# Altium schematic sheet 7 Inch Module.SchDoc: 7" TFT LCD (part 2 of 3)
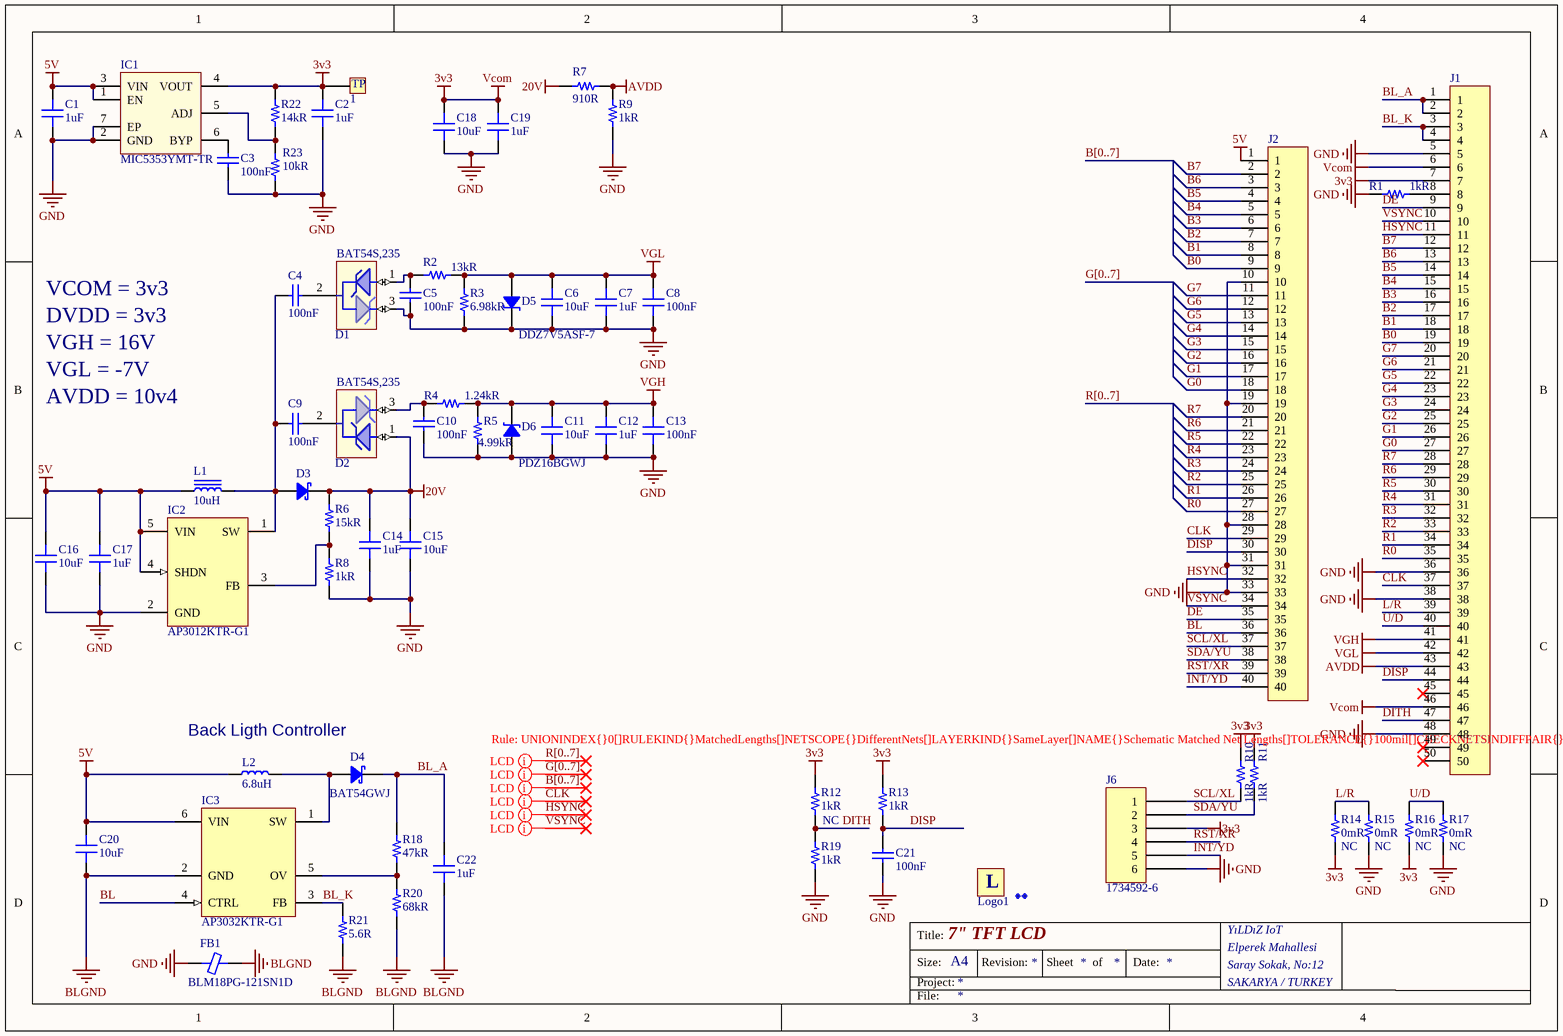
[diagram p1: 7 Inch Module.SchDoc]
## Library data of the parts
1 = Test Point: Custom Test Point
C1 C2 C7 C12 C14 C17 C19 = Capacitor - Ceramic: Ceramic, SMT Capacitor; Manufacturer: Samsung; Manufacturer Part Number: CL10A105KP8NNNC; Tolerance: 10%; Voltage Rating: 10V; Dielectric: X5R; Supplier 1: Digi-Key; Supplier Part Number 1: 1276-1182-1-ND; Stock 1: 4590831; Pricing 1: 1 = 0,10000, 10 = 0,03800, 100 = 0,01680, 500 = 0,01200, 1000 = 0,00943 (USD); RoHS: Yes; Mount: Surface Mount; Case/Package: 0603; Case Code (Metric): 1608; Case Code (Imperial): 0603; Contact Plating: Tin; Min Operating Temperature: -55°C; Max Operating Temperature: 85°C; Packaging: Tape and Reel; Package Quantity: 1; Capacitance: 1uF; Voltage: 10V; Length: 1.6mm; Height: 0.8mm; Width: 0.031inch; Thickness: 0.035inch; Depth: 0.8mm; Radiation Hardening: No; ComponentLink1URL: https://datasheet.ciiva.com/15195/getdatasheetpartid-358616-15195708.pdf?src-supplier=Verical; ComponentLink1Description: https://datasheet.ciiva.com/15195/getdatasheetpartid-358616-15195708.pdf?src-supplier=Verical; ComponentLink2URL: https://datasheet.ciiva.com/16358/cl05b104kq5nnnc-16358431.pdf?src-supplier=Future+Electronics; ComponentLink2Description: https://datasheet.ciiva.com/16358/cl05b104kq5nnnc-16358431.pdf?src-supplier=Future+Electronics
C3-C5 C9 C10 C21 = Cap - Ceramic: Capacitor, Ceramic; Manufacturer: Samsung; Manufacturer Part Number: CL10A104KA8NNNC; Tolerance: 10%; Voltage Rating: 25V; Dielectric: X5R; Supplier 1: Digi-Key; Supplier Part Number 1: 1276-1857-1-ND; Stock 1: 978306; Pricing 1: 1 = 0,10000, 10 = 0,04600, 100 = 0,02070, 500 = 0,01478, 1000 = 0,01162 (USD); RoHS: Yes; Mount: Surface Mount; Case/Package: 0603; Case Code (Metric): 1608; Case Code (Imperial): 0603; Contact Plating: Tin; Min Operating Temperature: -55°C; Max Operating Temperature: 85°C; Package Quantity: 1; Packaging: Tape and Reel; Capacitance: 100nF; Voltage Rating (DC): 25V; Termination: Wraparound; Length: 0.063inch; Width: 0.031inch; Thickness: 0.035inch; Lead Free: Lead Free; ComponentLink1URL: http://www.samsungsem.com/kr/support/library/product-catalog/mlcc.jsp; ComponentLink1Description: http://www.samsungsem.com/kr/support/library/product-catalog/mlcc.jsp; Price: 0,1
C6 C11 C15 C16 C18 C20 = Capacitor - Ceramic: Ceramic, SMT Capacitor; Manufacturer: Samsung; Manufacturer Part Number: CL10A106MQ8NNNC; Tolerance: 20%; Voltage Rating: 6.3V; Dielectric: X5R; Supplier 1: Digi-Key; Supplier Part Number 1: 1276-1119-1-ND; Stock 1: 4408315; Pricing 1: 1 = 0,15000, 10 = 0,11000, 100 = 0,05150, 500 = 0,03614, 1000 = 0,02992 (USD); RoHS: Yes; Mount: Surface Mount; Case/Package: 0603; Case Code (Metric): 1608; Case Code (Imperial): 0603; Contact Plating: Tin; Min Operating Temperature: -55°C; Max Operating Temperature: 85°C; Package Quantity: 1; Packaging: Tape and Reel; Capacitance: 10uF; Voltage: 6.3V; Length: 1.6mm; Height: 0.8mm; Width: 0.031inch; Thickness: 0.035inch; Depth: 0.8mm; Radiation Hardening: No; ComponentLink1URL: https://datasheet.ciiva.com/25798/cl10a106mq8nnnc-25798320.pdf?src-supplier=Digi-Key; ComponentLink1Description: https://datasheet.ciiva.com/25798/cl10a106mq8nnnc-25798320.pdf?src-supplier=Digi-Key; ComponentLink2URL: https://datasheet.ciiva.com/26838/getdatasheetpartid-357557-26838347.pdf?src-supplier=Verical; ComponentLink2Description: https://datasheet.ciiva.com/26838/getdatasheetpartid-357557-26838347.pdf?src-supplier=Verical; ComponentLink3URL: https://datasheet.ciiva.com/16437/cl05b104kq5nnnc-16437327.pdf?src-supplier=Future+Electronics; ComponentLink3Description: https://datasheet.ciiva.com/16437/cl05b104kq5nnnc-16437327.pdf?src-supplier=Future+Electronics
C8 C13 = Capacitor - Ceramic: Ceramic, SMT Capacitor; Manufacturer: Samsung; Manufacturer Part Number: CL10A104KA8NNNC; Dielectric: X5R; Voltage Rating (DC): 25V; Tolerance: 10%; ComponentLink1URL: https://datasheet.ciiva.com/15195/getdatasheetpartid-358616-15195708.pdf?src-supplier=Verical; ComponentLink1Description: https://datasheet.ciiva.com/15195/getdatasheetpartid-358616-15195708.pdf?src-supplier=Verical; ComponentLink2URL: https://datasheet.ciiva.com/16358/cl05b104kq5nnnc-16358431.pdf?src-supplier=Future+Electronics; ComponentLink2Description: https://datasheet.ciiva.com/16358/cl05b104kq5nnnc-16358431.pdf?src-supplier=Future+Electronics; Supplier 1: Digi-Key; Supplier Part Number 1: 1276-1857-1-ND; Stock 1: 1217365; Pricing 1: 1 = 0,10000, 10 = 0,04500, 100 = 0,02000, 500 = 0,01428, 1000 = 0,01122 (USD); RoHS: Yes; Mount: Surface Mount; Case/Package: 0603; Contact Plating: Tin; Case Code (Metric): 1608; Case Code (Imperial): 0603; Min Operating Temperature: -55°C; Max Operating Temperature: 85°C; Termination: Wraparound; Package Quantity: 1; Packaging: Tape and Reel; Capacitance: 100nF; Voltage Rating: 25V; Length: 0.063inch; Thickness: 0.035inch; Width: 0.031inch; Lead Free: Lead Free; ComponentLink3URL: https://datasheet.ciiva.com/25780/cl10a104ka8nnnc-25780966.pdf?src-supplier=Digi-Key; ComponentLink3Description: https://datasheet.ciiva.com/25780/cl10a104ka8nnnc-25780966.pdf?src-supplier=Digi-Key
C22 = Capacitor - Ceramic: Ceramic, SMT Capacitor; Manufacturer: Samsung; Manufacturer Part Number: CL10A105KO8NNNC; Tolerance: 10%; Voltage Rating: 16V; Dielectric: X5R; Supplier 1: Digi-Key; Supplier Part Number 1: 1276-1034-1-ND; Stock 1: 800480; Pricing 1: 1 = 0,10000, 10 = 0,03800, 100 = 0,01680, 500 = 0,01198, 1000 = 0,00941 (USD); RoHS: Yes; Mount: Surface Mount; Case/Package: 0603; Case Code (Metric): 1608; Case Code (Imperial): 0603; Material: Ceramic; Contact Plating: Tin; Min Operating Temperature: -55°C; Max Operating Temperature: 85°C; Package Quantity: 1; Packaging: Tape and Reel; Capacitance: 1uF; Voltage: 16V; Voltage Rating (DC): 16V; Length: 1.6mm; Height: 0.8mm; Width: 0.031inch; Thickness: 0.035inch; Depth: 0.8mm; Radiation Hardening: No; Lead Free: Lead Free; ComponentLink1URL: http://www1.futureelectronics.com/doc/SAMSUNG/CL10A105KO8NNNC.pdf?src-supplier=Future+Electronics; ComponentLink1Description: http://www1.futureelectronics.com/doc/SAMSUNG/CL10A105KO8NNNC.pdf?src-supplier=Future+Electronics; ComponentLink2URL: https://www.verical.com/server-webapp/html/getDatasheet?partID=359688&src-supplier=Verical; ComponentLink2Description: https://www.verical.com/server-webapp/html/getDatasheet?partID=359688&src-supplier=Verical; ComponentLink3URL: https://produktinfo.conrad.com/datenblaetter/450000-474999/458190-da-01-en-VS_KONDENSATOR_0603.pdf?src-supplier=Conrad; ComponentLink3Description: https://produktinfo.conrad.com/datenblaetter/450000-474999/458190-da-01-en-VS_KONDENSATOR_0603.pdf?src-supplier=Conrad
D1 D2 = Diode Schottky Barier Array: TVS Array; Manufacturer: Nexperia; ComponentLink2Description: SMD; Supplier 1: Digi-Key; Supplier Part Number 1: 1727-1868-1-ND; Manufacturer Part Number: BAT54S,235; Stock 1: 9232; Pricing 1: 1 = 0,14000, 10 = 0,12500, 25 = 0,11880, 100 = 0,05230, 250 = 0,05016, 500 = 0,04104, 1000 = 0,02850, 2500 = 0,02489, 5000 = 0,02233 (USD); RoHS: No; ComponentLink1URL: https://assets.nexperia.com/documents/data-sheet/BAT54_SER.pdf?src-supplier=Digi-Key; ComponentLink1Description: https://assets.nexperia.com/documents/data-sheet/BAT54_SER.pdf?src-supplier=Digi-Key
D3 = Diode Schottky: Zener Diode; Manufacturer: Diodes; Forward Voltage: 450mV; Forward Current: 1A; Max Power Dissipation: 450mW; Max Repetitive Reverse Voltage (Vrrm): 40V; Max Forward Surge Current (Ifsm): 25A; Polarity: Standard; Capacitance: 110pF; Peak Reverse Current: 50uA; Element Configuration: Single; Supplier 1: Digi-Key; Supplier Part Number 1: 1N5819HW-FDICT-ND; Manufacturer Part Number: 1N5819HW-7-F; Stock 1: 392857; Pricing 1: 1 = 0,40000, 10 = 0,30100, 25 = 0,26360, 100 = 0,14310, 250 = 0,14240, 500 = 0,11678, 1000 = 0,08664 (USD); RoHS: Yes; Case/Package: SOD-123-2; Number of Pins: 2; Weight: 0.000353oz; Contact Plating: Tin,Matte; Min Operating Temperature: -65°C; Max Operating Temperature: 125°C; Package Quantity: 3000; Average Rectified Current: 1A; Peak Non-Repetitive Surge Current: 25A; Termination: SMD/SMT; Voltage Rating (DC): 40V; Current Rating: 1A; Max Reverse Voltage (DC): 40V; Output Current: 1A; Packaging: Tape and Reel; Length: 2.85mm; Height: 1.25mm; Width: 1.7mm; Radiation Hardening: No; REACH SVHC: No SVHC; Lead Free: Lead Free; ComponentLink1URL: https://datasheet.ciiva.com/16303/ds30217-16303296.pdf?src-supplier=Future+Electronics; ComponentLink1Description: https://datasheet.ciiva.com/16303/ds30217-16303296.pdf?src-supplier=Future+Electronics; ComponentLink2URL: https://datasheet.ciiva.com/27092/1538419-27092484.pdf?src-supplier=Jameco; ComponentLink2Description: https://datasheet.ciiva.com/27092/1538419-27092484.pdf?src-supplier=Jameco; ComponentLink3URL: https://datasheet.ciiva.com/912/ds30217-912801.pdf?src-supplier=Digi-Key; ComponentLink3Description: https://datasheet.ciiva.com/912/ds30217-912801.pdf?src-supplier=Digi-Key; ComponentLink4URL: https://datasheet.ciiva.com/912/ds30217-912803.pdf?src-supplier=Digi-Key; ComponentLink4Description: https://datasheet.ciiva.com/912/ds30217-912803.pdf?src-supplier=Digi-Key; ComponentLink5URL: https://datasheet.ciiva.com/8303/ds30217-8303132.pdf?src-supplier=Avnet; ComponentLink5Description: https://datasheet.ciiva.com/8303/ds30217-8303132.pdf?src-supplier=Avnet; ComponentLink6URL: https://datasheet.ciiva.com/25919/ds30217-25919644.pdf?src-supplier=Avnet+Europe; ComponentLink6Description: https://datasheet.ciiva.com/25919/ds30217-25919644.pdf?src-supplier=Avnet+Europe; ComponentLink7URL: https://datasheet.ciiva.com/1177/ds30217-1177089.pdf?src-supplier=Element14; ComponentLink7Description: https://datasheet.ciiva.com/1177/ds30217-1177089.pdf?src-supplier=Element14; ComponentLink8URL: https://datasheet.ciiva.com/912/ds30217-912802.pdf?src-supplier=Digi-Key; ComponentLink8Description: https://datasheet.ciiva.com/912/ds30217-912802.pdf?src-supplier=Digi-Key
D4 = Diode Schottky: Zener Diode; Manufacturer: NXP Semiconductors; Supplier 1: Digi-Key; Supplier Part Number 1: 1727-7328-1-ND; Manufacturer Part Number: BAT54GWJ; Stock 1: 35357; Pricing 1: 1 = 0,14000, 10 = 0,13100, 100 = 0,07140, 500 = 0,04396, 1000 = 0,02997 (USD)
D5 = Diode Zener: Zener Diode; Manufacturer: Diodes; Description: Diodes Inc DDZ7V5ASF-7 Zener Diode, 7.0V 2.5% 500 mW SMT 2-Pin SOD-323F; Voltage Tolerance: 2.63%; Zener Current: 7.5uA; Forward Voltage: 900mV; Zener Voltage: 7.04V; Impedance: 30R; Test Current: 20mA; Element Configuration: Single; Power Rating: 500mW; Tolerance: 3%; Supplier 1: Digi-Key; Supplier Part Number 1: DDZ7V5ASF-7DICT-ND; Manufacturer Part Number: DDZ7V5ASF-7; Stock 1: 16; Pricing 1: 1 = 0,15000, 10 = 0,14100, 25 = 0,13400, 100 = 0,05890, 250 = 0,05656, 500 = 0,04626, 1000 = 0,03213 (USD); RoHS: Yes; Mount: Surface Mount; Number of Pins: 2; Min Operating Temperature: -65°C; Max Operating Temperature: 150°C; Peak Reverse Current: 7.5uA; Max Reverse Leakage Current: 7.5uA; Max Power Dissipation: 500mW; Package Quantity: 3000; Packaging: Tape and Reel; Length: 2.5mm; Height: 0.75mm; Width: 1.25mm; Radiation Hardening: No; Lead Free: Lead Free; REACH SVHC: No SVHC; ComponentLink1URL: https://datasheet.ciiva.com/30478/0900766b8115c2de-30478492.pdf?src-supplier=RSComponents; ComponentLink1Description: https://datasheet.ciiva.com/30478/0900766b8115c2de-30478492.pdf?src-supplier=RSComponents; ComponentLink2URL: https://datasheet.ciiva.com/13079/ds31987-65362-13079116.pdf?src-supplier=Mouser; ComponentLink2Description: https://datasheet.ciiva.com/13079/ds31987-65362-13079116.pdf?src-supplier=Mouser
D6 = Diode Zener: Zener Diode; Manufacturer: Nexperia; Description: PDZ-B Series 16 V ±2% 400 mW Surface Mount Voltage Regulator Diode - SOD-323; Supplier 1: Digi-Key; Supplier Part Number 1: 1727-7765-1-ND; Manufacturer Part Number: PDZ16BGWJ; Stock 1: 19182; Pricing 1: 1 = 0,17000, 10 = 0,15400, 25 = 0,14640, 100 = 0,06440, 250 = 0,06176, 500 = 0,05054, 1000 = 0,03510, 2500 = 0,03066, 5000 = 0,02750 (USD); RoHS: No
FB1 = Ferrite Chip: SMT Ferrite Chip; Manufacturer: Murata; Material: Ferrite,Steel; Tolerance: 25%; Impedance: 120R; Max Current Rating: 2A; Number of Lines: 1; DC Resistance (DCR): 50mR; Test Frequency: 100MHz; Shielding: Unshielded; Supplier 1: Digi-Key; Supplier Part Number 1: 490-1037-1-ND; Manufacturer Part Number: BLM18PG-121SN1D; Stock 1: 1352097; Pricing 1: 1 = 0,10000, 10 = 0,07600, 25 = 0,06840, 50 = 0,05000, 100 = 0,04330, 250 = 0,03416, 500 = 0,02884, 1000 = 0,02429 (USD); RoHS: Yes; Case/Package: 0603; Number of Pins: 2; Core Material: Ferrite; Case Code (Metric): 1608; Case Code (Imperial): 0603; Min Operating Temperature: -55°C; Max Operating Temperature: 125°C; Package Quantity: 1; Packaging: Tape and Reel; Current Rating: 2A; Max DC Current: 2A; Termination: SMD/SMT; DC Current: 2A; Frequency: 100MHz; Number of Circuits: 1; Length: 1.6mm; Height: 0.8mm; Width: 0.8mm; Depth: 0.8mm; Radiation Hardening: No; REACH SVHC: No SVHC; Lead Free: Lead Free; ComponentLink1URL: http://www.farnell.com/datasheets/1740433.pdf?src-supplier=Avnet; ComponentLink1Description: http://www.farnell.com/datasheets/1740433.pdf?src-supplier=Avnet; ComponentLink2URL: http://www.farnell.com/datasheets/1740433.pdf?src-supplier=Farnell; ComponentLink2Description: http://www.farnell.com/datasheets/1740433.pdf?src-supplier=Farnell; ComponentLink3URL: http://www.farnell.com/datasheets/1740433.pdf?src-supplier=Element14; ComponentLink3Description: http://www.farnell.com/datasheets/1740433.pdf?src-supplier=Element14; ComponentLink4URL: https://www.murata.com/en-us/products/productdata/8796738650142/ENFA0003.pdf?src-supplier=Digi-Key; ComponentLink4Description: https://www.murata.com/en-us/products/productdata/8796738650142/ENFA0003.pdf?src-supplier=Digi-Key; ComponentLink5URL: http://www.farnell.com/datasheets/1740433.pdf?src-supplier=Arrow; ComponentLink5Description: http://www.farnell.com/datasheets/1740433.pdf?src-supplier=Arrow; ComponentLink6URL: http://www.farnell.com/datasheets/1740433.pdf?src-supplier=Distrelec; ComponentLink6Description: http://www.farnell.com/datasheets/1740433.pdf?src-supplier=Distrelec; ComponentLink7URL: http://uk.rs-online.com/webdocs/13d6/0900766b813d688c.pdf?src-supplier=RSComponents; ComponentLink7Description: http://uk.rs-online.com/webdocs/13d6/0900766b813d688c.pdf?src-supplier=RSComponents; ComponentLink8URL: http://www.farnell.com/datasheets/1740433.pdf?src-supplier=Jameco; ComponentLink8Description: http://www.farnell.com/datasheets/1740433.pdf?src-supplier=Jameco; ComponentLink9URL: http://www.farnell.com/datasheets/1740433.pdf?src-supplier=Avnet+Europe; ComponentLink9Description: http://www.farnell.com/datasheets/1740433.pdf?src-supplier=Avnet+Europe; ComponentLink10URL: http://www.produktinfo.conrad.com/datenblaetter/425000-449999/442365-da-01-en-CHIP_DROSSEL_0603_120R_2000MA_1_6X0_8MM.pdf?src-supplier=Conrad; ComponentLink10Description: http://www.produktinfo.conrad.com/datenblaetter/425000-449999/442365-da-01-en-CHIP_DROSSEL_0603_120R_2000MA_1_6X0_8MM.pdf?src-supplier=Conrad; ComponentLink11URL: http://www.produktinfo.conrad.com/datenblaetter/1100000-1199999/001172297-da-01-en-DROSSEL_0603_120R_1_6X0_8MM_4000ST.pdf?src-supplier=Conrad; ComponentLink11Description: http://www.produktinfo.conrad.com/datenblaetter/1100000-1199999/001172297-da-01-en-DROSSEL_0603_120R_1_6X0_8MM_4000ST.pdf?src-supplier=Conrad
Fid1 Fid2 = Fiducial: Part Number: Fid-Mark; Artikkelnr Noca: N.A.; Manufacturer: *; Manufacturer Part Number: *; Datasheet: *; LatestRevisionDate: 2009-12-12; Pin Count: 1; Publisher: Nordic Semiconductor; Published: 2009-12-12; Value: *; Note: *; Supplier: *; Supplier part number: *; 2nd source Supplier: *; 2nd source part number: *; Footprint Doc: Fiducial; Artikkelnr Simpro: N.A.
IC1 = MICROCHIP MIC5353: Integrated Circuit; ComponentLink1URL: http://www.farnell.com/datasheets/2245202.pdf?src-supplier=Farnell; ComponentLink1Description: http://www.farnell.com/datasheets/2245202.pdf?src-supplier=Farnell; ComponentLink2URL: http://www.microchip.com/mymicrochip/filehandler.aspx?ddocname=en579989&src-supplier=Digi-Key; ComponentLink2Description: http://www.microchip.com/mymicrochip/filehandler.aspx?ddocname=en579989&src-supplier=Digi-Key; ComponentLink3URL: http://www.farnell.com/datasheets/1692673.pdf?src-supplier=Element14; ComponentLink3Description: http://www.farnell.com/datasheets/1692673.pdf?src-supplier=Element14; Supplier 1: Digi-Key; Supplier Part Number 1: 576-3681-1-ND; Manufacturer: Microchip; Manufacturer Part Number: MIC5353YMT-TR; Stock 1: 1004; Pricing 1: 1 = 0,34000, 25 = 0,28000, 100 = 0,26000 (USD); RoHS: Yes; ComponentLink4URL: https://datasheet.ciiva.com/2049/mic5353-2049344.pdf?src-supplier=Digi-Key; ComponentLink4Description: https://datasheet.ciiva.com/2049/mic5353-2049344.pdf?src-supplier=Digi-Key; ComponentLink5URL: https://datasheet.ciiva.com/2049/mic5353-2049342.pdf?src-supplier=Digi-Key; ComponentLink5Description: https://datasheet.ciiva.com/2049/mic5353-2049342.pdf?src-supplier=Digi-Key; ComponentLink6URL: https://datasheet.ciiva.com/2049/mic5353-2049343.pdf?src-supplier=Digi-Key; ComponentLink6Description: https://datasheet.ciiva.com/2049/mic5353-2049343.pdf?src-supplier=Digi-Key
IC2 = DIODES AP3012: 1.5MHz STEP-UP DC-DC CONVERTER; Manufacturer: Diodes; Output Voltage: 29V; Operating Supply Current: 100nA; Min Supply Voltage: 1V; Number of Outputs: 1; Max Output Current: 500mA; Min Output Voltage: 1.25V; Min Input Voltage: 2.6V; Max Input Voltage: 16V; Efficiency: 85%; Synchronous Rectifier: No; Topology: Boost; Output Type: Adjustable; Output Configuration: Positive; Supplier 1: Digi-Key; Supplier Part Number 1: AP3012KTR-G1DICT-ND; Manufacturer Part Number: AP3012KTR-G1; Stock 1: 30355; Pricing 1: 1 = 0,47000, 10 = 0,38000, 25 = 0,34760, 100 = 0,23430, 250 = 0,19392, 500 = 0,17776, 1000 = 0,13332 (USD); RoHS: Yes; Mount: Surface Mount; Case/Package: SOT-23-5; Number of Pins: 5; Weight: 0.001058oz; Min Operating Temperature: -40°C; Max Operating Temperature: 85°C; Packaging: Tape and Reel; Max Output Voltage: 29V; Output Current: 500mA; Switching Frequency: 1.5MHz; Package Quantity: 3000; Operating Supply Voltage: 16V; Lead Free: Lead Free; ComponentLink1URL: https://datasheet.ciiva.com/29885/ap3012-29885792.pdf?src-supplier=Avnet; ComponentLink1Description: https://datasheet.ciiva.com/29885/ap3012-29885792.pdf?src-supplier=Avnet; ComponentLink2URL: https://datasheet.ciiva.com/29735/ap3012-29735077.pdf?src-supplier=Digi-Key; ComponentLink2Description: https://datasheet.ciiva.com/29735/ap3012-29735077.pdf?src-supplier=Digi-Key; ComponentLink3URL: https://datasheet.ciiva.com/29735/ap3012-29735068.pdf?src-supplier=Digi-Key; ComponentLink3Description: https://datasheet.ciiva.com/29735/ap3012-29735068.pdf?src-supplier=Digi-Key
IC3 = DIODES AP3032: Manufacturer: Diodes; Number of Outputs: 1; Frequency: 1MHz; Max Supply Voltage: 9V; Output Current per Channel: 1.4A; Min Input Voltage: 2.7V; Max Output Voltage: 38V; Switching Frequency: 750kHz; Topology: Boost; Dimming: PWM; Supplier 1: Digi-Key; Supplier Part Number 1: AP3032KTR-G1DICT-ND; Manufacturer Part Number: AP3032KTR-G1; Stock 1: 8311; Pricing 1: 1 = 0,48000, 10 = 0,36500, 100 = 0,22740, 500 = 0,15558, 1000 = 0,11968 (USD); RoHS: Yes; Mount: Surface Mount; Case/Package: SOT-23-6; Number of Pins: 6; Weight: 0.000529oz; Min Operating Temperature: -40°C; Max Operating Temperature: 85°C; Package Quantity: 3000; Packaging: Tape and Reel; Max Input Voltage: 9V; Number of Channels: 1; Lead Free: Lead Free; ComponentLink1URL: https://www.diodes.com/assets/Datasheets/AP3032.pdf?src-supplier=Digi-Key; ComponentLink1Description: https://www.diodes.com/assets/Datasheets/AP3032.pdf?src-supplier=Digi-Key
J1 = FPC-50: Connector; Manufacturer: Amphenol FCI; Actuator Material: Glass,Thermoplastic; Current Rating: 500mA; Voltage Rating: 50V; Contact Resistance: 30mR; Number of Positions: 50; Contact Location: Bottom; Insulation Resistance: 100MR; Gender: Receptacle; Pitch: 0.5mm; Supplier 1: Digi-Key; Supplier Part Number 1: 609-1197-1-ND; Manufacturer Part Number: 62684-501100ALF; Stock 1: 6713; Pricing 1: 1 = 0,96000, 10 = 0,84700, 25 = 0,79680, 50 = 0,76360, 100 = 0,73040, 250 = 0,66396, 500 = 0,59756, 1000 = 0,53117 (USD); RoHS: Yes; Mount: Surface Mount; Contact Material: Bronze; Contact Plating: Gold; Housing Color: Beige; Housing Material: Thermoplastic; Min Operating Temperature: -55°C; Max Operating Temperature: 85°C; Package Quantity: 2000; Packaging: Tape and Reel; Number of Rows: 1; Orientation: Right Angle; Termination: Solder; Number of Contacts: 50; Max Voltage Rating (AC): 50V; Max Voltage Rating (DC): 50V; Length: 30.5mm; Width: 5mm; Depth: 5mm; Radiation Hardening: No; REACH SVHC: No SVHC; Lead Free: Lead Free; Flammability Rating: UL94 V-0; ComponentLink1URL: https://datasheet.ciiva.com/670/62684-670208.pdf?src-supplier=Digi-Key; ComponentLink1Description: https://datasheet.ciiva.com/670/62684-670208.pdf?src-supplier=Digi-Key; ComponentLink2URL: https://datasheet.ciiva.com/15176/getdatasheetpartid-175576-15176517.pdf?src-supplier=Verical; ComponentLink2Description: https://datasheet.ciiva.com/15176/getdatasheetpartid-175576-15176517.pdf?src-supplier=Verical; ComponentLink3URL: https://datasheet.ciiva.com/16660/62684-16660229.pdf?src-supplier=Avnet+Europe; ComponentLink3Description: https://datasheet.ciiva.com/16660/62684-16660229.pdf?src-supplier=Avnet+Europe; ComponentLink4URL: https://datasheet.ciiva.com/10367/62684-10367670.pdf?src-supplier=Avnet; ComponentLink4Description: https://datasheet.ciiva.com/10367/62684-10367670.pdf?src-supplier=Avnet; ComponentLink5URL: https://datasheet.ciiva.com/8038/62684-8038135.pdf?src-supplier=Element14; ComponentLink5Description: https://datasheet.ciiva.com/8038/62684-8038135.pdf?src-supplier=Element14; ComponentLink6URL: https://datasheet.ciiva.com/14640/70236842-14640812.pdf?src-supplier=Allied+Electronics; ComponentLink6Description: https://datasheet.ciiva.com/14640/70236842-14640812.pdf?src-supplier=Allied+Electronics; ComponentLink7URL: https://datasheet.ciiva.com/670/62684-670206.pdf?src-supplier=Digi-Key; ComponentLink7Description: https://datasheet.ciiva.com/670/62684-670206.pdf?src-supplier=Digi-Key; ComponentLink8URL: https://datasheet.ciiva.com/670/62684-670207.pdf?src-supplier=Digi-Key; ComponentLink8Description: https://datasheet.ciiva.com/670/62684-670207.pdf?src-supplier=Digi-Key
J2 = FPC-40: Connector; Manufacturer: Amphenol FCI; Actuator Material: Glass,Thermoplastic; Number of Positions: 40; Current Rating: 500mA; Voltage Rating: 50V; Contact Location: Bottom; Insulation Resistance: 100MR; Gender: Receptacle; Contact Resistance: 30mR; Pitch: 0.5mm; Supplier 1: Digi-Key; Supplier Part Number 1: 609-1195-1-ND; Manufacturer Part Number: 62684-401100ALF; Stock 1: 13351; Pricing 1: 1 = 0,97000, 10 = 0,85600, 25 = 0,80600, 50 = 0,77240, 100 = 0,73880, 250 = 0,67168, 500 = 0,60450, 1000 = 0,53733 (USD); RoHS: Yes; Mount: Surface Mount; Housing Material: Thermoplastic; Housing Color: Beige; Contact Material: Bronze; Contact Plating: Gold; Min Operating Temperature: -55°C; Max Operating Temperature: 85°C; Termination: Solder; Packaging: Tape and Reel; Orientation: Right Angle; Number of Contacts: 40; Max Voltage Rating (AC): 50V; Max Voltage Rating (DC): 50V; Number of Rows: 1; Package Quantity: 2000; Length: 25.5mm; Depth: 5mm; Width: 5mm; Flammability Rating: UL94 V-0; REACH SVHC: No SVHC; Lead Free: Lead Free; ComponentLink1URL: https://datasheet.ciiva.com/25631/0900766b8118e51f-25631168.pdf?src-supplier=RSComponents; ComponentLink1Description: https://datasheet.ciiva.com/25631/0900766b8118e51f-25631168.pdf?src-supplier=RSComponents; ComponentLink2URL: https://datasheet.ciiva.com/3112/62684-3112007.pdf?src-supplier=Avnet; ComponentLink2Description: https://datasheet.ciiva.com/3112/62684-3112007.pdf?src-supplier=Avnet; ComponentLink3URL: https://datasheet.ciiva.com/670/62684-670200.pdf?src-supplier=Digi-Key; ComponentLink3Description: https://datasheet.ciiva.com/670/62684-670200.pdf?src-supplier=Digi-Key; ComponentLink4URL: https://datasheet.ciiva.com/670/62684-670201.pdf?src-supplier=Digi-Key; ComponentLink4Description: https://datasheet.ciiva.com/670/62684-670201.pdf?src-supplier=Digi-Key; ComponentLink5URL: https://datasheet.ciiva.com/670/62684-670202.pdf?src-supplier=Digi-Key; ComponentLink5Description: https://datasheet.ciiva.com/670/62684-670202.pdf?src-supplier=Digi-Key; ComponentLink6URL: https://datasheet.ciiva.com/16659/62684-16659882.pdf?src-supplier=Avnet+Europe; ComponentLink6Description: https://datasheet.ciiva.com/16659/62684-16659882.pdf?src-supplier=Avnet+Europe; ComponentLink7URL: https://datasheet.ciiva.com/16709/70236840-16709916.pdf?src-supplier=Allied+Electronics; ComponentLink7Description: https://datasheet.ciiva.com/16709/70236840-16709916.pdf?src-supplier=Allied+Electronics; ComponentLink8URL: https://datasheet.ciiva.com/3112/62684-3112397.pdf?src-supplier=Avnet; ComponentLink8Description: https://datasheet.ciiva.com/3112/62684-3112397.pdf?src-supplier=Avnet; ComponentLink9URL: https://datasheet.ciiva.com/5772/62684-5772782.pdf?src-supplier=Farnell; ComponentLink9Description: https://datasheet.ciiva.com/5772/62684-5772782.pdf?src-supplier=Farnell
J6 = 6 Pin: Manufacturer: TE Connectivity; Current Rating: 500mA; Voltage Rating: 250V; Gender: Female; Contact Resistance: 35mR; Number of Positions: 6; Contact Location: Bottom; Shielding: Unshielded; Connector Type: Receptacle; Wire/Cable Type: Flat Flex; Connector System: Flex-to-Board; Plating Thickness: 0.025um; Mating Alignment: Yes (With); PCB Mount Alignment: No (Without); PCB Mount Retention: With; PCB Mounting Orientation: Right Angle; Pitch: 0.5mm; Supplier 1: Digikey; Supplier Part Number 1: A144895CT-ND; Manufacturer Part Number: 1734592-6; Stock 1: 14000; Pricing 1: 1 = 0,44000, 10 = 0,41400, 25 = 0,37280, 50 = 0,33140, 100 = 0,31760, 250 = 0,28996, 500 = 0,27616, 1000 = 0,22783 (USD); Mount: Surface Mount; Contact Material: Bronze; Contact Plating: Gold; Housing Color: Natural; Housing Material: Polymer; Min Operating Temperature: -40°C; Max Operating Temperature: 85°C; Package Quantity: 2000; Packaging: Tape and Reel; Number of Rows: 1; Termination: SMD/SMT; Number of Contacts: 6; Max Voltage Rating (AC): 250V; Orientation: Right Angle; Sealable: No (Without); Shrouded: Yes (With); Contact Current Rating: 500mA; Length: 8.43mm; Height: 2.05mm; Width: 5.1mm; Depth: 5.1mm; Radiation Hardening: No; Flammability Rating: UL94 V-0; ELV: Compliant; ComponentLink1URL: https://datasheet.ciiva.com/672/eng-cd-1734592-c-c-1734592-672627.pdf?src-supplier=Digi-Key; ComponentLink1Description: https://datasheet.ciiva.com/672/eng-cd-1734592-c-c-1734592-672627.pdf?src-supplier=Digi-Key; ComponentLink2URL: https://datasheet.ciiva.com/16658/eng-ds-1-1773440-6-0506-16658810.pdf?src-supplier=Avnet+Europe; ComponentLink2Description: https://datasheet.ciiva.com/16658/eng-ds-1-1773440-6-0506-16658810.pdf?src-supplier=Avnet+Europe; ComponentLink3URL: https://datasheet.ciiva.com/10366/eng-ds-1-1773440-6-0506-10366142.pdf?src-supplier=Avnet; ComponentLink3Description: https://datasheet.ciiva.com/10366/eng-ds-1-1773440-6-0506-10366142.pdf?src-supplier=Avnet; ComponentLink4URL: http://datasheet.octopart.com/1734592-6-TE-Connectivity-datasheet-502047.pdf?src-supplier=Newark; ComponentLink4Description: http://datasheet.octopart.com/1734592-6-TE-Connectivity-datasheet-502047.pdf?src-supplier=Newark; ComponentLink5URL: http://sigma.octopart.com/12115691/technical_drawing/TE-Connectivity-1734592-6.pdf?src-supplier=TE+Connectivity; ComponentLink5Description: http://sigma.octopart.com/12115691/technical_drawing/TE-Connectivity-1734592-6.pdf?src-supplier=TE+Connectivity; ComponentLink6URL: http://sigma.octopart.com/17020802/technical_drawing/TE-Connectivity-1734592-6.pdf?src-supplier=TE+Connectivity; ComponentLink6Description: http://sigma.octopart.com/17020802/technical_drawing/TE-Connectivity-1734592-6.pdf?src-supplier=TE+Connectivity; ComponentLink7URL: http://datasheet.octopart.com/1734592-6-TE-Connectivity---AMP-datasheet-13533107.pdf?src-supplier=TE+Connectivity; ComponentLink7Description: http://datasheet.octopart.com/1734592-6-TE-Connectivity---AMP-datasheet-13533107.pdf?src-supplier=TE+Connectivity
L1 = Inductor Iron Core: Manufacturer: Delta Electronics/Cyntec; Manufacturer Part Number: SDET25201T-100MS; Current Rating: 900mA; Shielding: Unshielded; Self Resonant Frequency: 23MHz; Tolerance: 20%; DC Resistance (DCR): 172.9mR; Test Frequency: 100kHz; Supplier 1: Digi-Key; Supplier Part Number 1: 2037-SDET25201T-100MSCT-ND; Stock 1: 71037; Pricing 1: 1 = 0,26000, 10 = 0,23300, 100 = 0,16050, 500 = 0,13714 1000 = 0,10505 (USD); RoHS: Yes; Mount: Surface Mount; Case/Package: 1008; Number of Pins: 2; Case Code (Metric): 2520; Case Code (Imperial): 1008; Min Operating Temperature: -40°C; Max Operating Temperature: 105°C; Packaging: Tape and Reel; Package Quantity: 1000; Inductance: 10uH; Saturation Current: 900mA; Inductance Tolerance: 20%; Max DC Current: 900mA; Termination: SMD/SMT; DC Current: 900mA; Military Standard: Not; Length: 3.4mm; Height: 2.5mm; Width: 0.098inch; Height - Seated (Max): 0.106inch; Depth: 2.7mm; Radiation Hardening: No; REACH SVHC: Unknown; Lead Free: Lead Free; Halogen Free: Halogen Free; ComponentLink1URL: https://datasheet.ciiva.com/8001/1521599-8001889.pdf?src-supplier=Element14; ComponentLink1Description: https://datasheet.ciiva.com/8001/1521599-8001889.pdf?src-supplier=Element14; ComponentLink2URL: https://datasheet.ciiva.com/8001/1734578-8001891.pdf?src-supplier=Element14; ComponentLink2Description: https://datasheet.ciiva.com/8001/1734578-8001891.pdf?src-supplier=Element14; ComponentLink3URL: https://datasheet.ciiva.com/26871/getdatasheetpartid-638428-26871172.pdf?src-supplier=Verical; ComponentLink3Description: https://datasheet.ciiva.com/26871/getdatasheetpartid-638428-26871172.pdf?src-supplier=Verical; ComponentLink4URL: https://datasheet.ciiva.com/1040/cbc3225t100mr-ss-1040864.pdf?src-supplier=Digi-Key; ComponentLink4Description: https://datasheet.ciiva.com/1040/cbc3225t100mr-ss-1040864.pdf?src-supplier=Digi-Key; ComponentLink5URL: https://datasheet.ciiva.com/8498/cbc3225t100mr-ss-8498858.pdf?src-supplier=Avnet; ComponentLink5Description: https://datasheet.ciiva.com/8498/cbc3225t100mr-ss-8498858.pdf?src-supplier=Avnet
L2 = Inductor Air Core: Manufacturer: TDK; Manufacturer Part Number: MLZ2012M6R8WT000; Core Material: Ferrite; Tolerance: 20%; Current Rating: 350mA; Saturation Current: 220mA; Shielding: Shielded; DC Resistance (DCR): 520mR; Self Resonant Frequency: 60MHz; Test Frequency: 2MHz; Supplier 1: Digi-Key; Supplier Part Number 1: 445-6402-1-ND; Stock 1: 25001; Pricing 1: 1 = 0,14000, 10 = 0,12900, 100 = 0,08630, 500 = 0,07188, 1000 = 0,06038 (USD); RoHS: Yes; Mount: Surface Mount; Case/Package: 0805; Case Code (Metric): 2012; Case Code (Imperial): 0805; Min Operating Temperature: -55°C; Max Operating Temperature: 125°C; Packaging: Tape and Reel; Package Quantity: 1; Inductance: 6.8uH; Length: 0.079inch; Width: 0.049inch; Height - Seated (Max): 0.057inch; ComponentLink1URL: https://product.tdk.com/info/en/catalog/datasheets/inductor_commercial_decoupling_mlz2012_en.pdf?src-supplier=Digi-Key; ComponentLink1Description: https://product.tdk.com/info/en/catalog/datasheets/inductor_commercial_decoupling_mlz2012_en.pdf?src-supplier=Digi-Key
Logo1 = Logo: Schematic symbol for Logo
R1 R8-R13 R19 = Resistor_Chip: Ceramic, SMT Capacitor; Manufacturer: Yageo; Manufacturer Part Number: RC0603FR-071KL; Description: RES SMD 1K OHM 1% 1/10W 0603; Temperature Coefficient: 100ppm/°C; Tolerance: 1%; Power Rating: 100mW; Voltage Rating: 50V; ComponentLink1URL: https://datasheet.ciiva.com/2469/esr-2469603.pdf?src-supplier=Digi-Key; ComponentLink1Description: https://datasheet.ciiva.com/2469/esr-2469603.pdf?src-supplier=Digi-Key; ComponentLink2URL: https://datasheet.ciiva.com/2469/esr-2469604.pdf?src-supplier=Digi-Key; ComponentLink2Description: https://datasheet.ciiva.com/2469/esr-2469604.pdf?src-supplier=Digi-Key; ComponentLink3URL: https://datasheet.ciiva.com/2469/esr-2469605.pdf?src-supplier=Digi-Key; ComponentLink3Description: https://datasheet.ciiva.com/2469/esr-2469605.pdf?src-supplier=Digi-Key; Supplier 1: Digi-Key; Supplier Part Number 1: 311-1.00KHRCT-ND; Stock 1: 20586953; Pricing 1: 1 = 0,10000, 10 = 0,02300, 100 = 0,00940, 1000 = 0,00421, 2500 = 0,00366 (USD); RoHS: Yes; Case/Package: 0603; Contact Plating: Tin,Matte; Case Code (Imperial): 0603; Case Code (Metric): 1608; Min Operating Temperature: -55°C; Max Operating Temperature: 155°C; Composition: Thick Film; Resistance: 1kR; Packaging: Tape and Reel; Military Standard: Not; Termination: SMD/SMT; Length: 1.6mm; Height: 0.45mm; Depth: 0.8mm; Radiation Hardening: No; Lead Free: Lead Free; REACH SVHC: No SVHC; ComponentLink4URL: https://datasheet.ciiva.com/11808/0900766b80f96399-11808081.pdf?src-supplier=RSComponents; ComponentLink4Description: https://datasheet.ciiva.com/11808/0900766b80f96399-11808081.pdf?src-supplier=RSComponents; ComponentLink5URL: https://datasheet.ciiva.com/25906/pyu-rc0603-51-rohs-l-4-25906933.pdf?src-supplier=Avnet+Europe; ComponentLink5Description: https://datasheet.ciiva.com/25906/pyu-rc0603-51-rohs-l-4-25906933.pdf?src-supplier=Avnet+Europe; ComponentLink6URL: https://datasheet.ciiva.com/7660/1868787-7660790.pdf?src-supplier=Element14; ComponentLink6Description: https://datasheet.ciiva.com/7660/1868787-7660790.pdf?src-supplier=Element14; ComponentLink7URL: https://datasheet.ciiva.com/7746/1738695-7746279.pdf?src-supplier=Element14; ComponentLink7Description: https://datasheet.ciiva.com/7746/1738695-7746279.pdf?src-supplier=Element14; ComponentLink8URL: https://datasheet.ciiva.com/7746/1686128-7746280.pdf?src-supplier=Element14; ComponentLink8Description: https://datasheet.ciiva.com/7746/1686128-7746280.pdf?src-supplier=Element14; ComponentLink9URL: https://datasheet.ciiva.com/28386/pyu-rc0603-51-rohs-l-4-28386648.pdf?src-supplier=Avnet+Europe; ComponentLink9Description: https://datasheet.ciiva.com/28386/pyu-rc0603-51-rohs-l-4-28386648.pdf?src-supplier=Avnet+Europe; ComponentLink10URL: https://datasheet.ciiva.com/7746/1738695-7746281.pdf?src-supplier=Element14; ComponentLink10Description: https://datasheet.ciiva.com/7746/1738695-7746281.pdf?src-supplier=Element14; ComponentLink11URL: https://datasheet.ciiva.com/8896/pyu-rc0603-51-rohs-l-4-8896106.pdf?src-supplier=Avnet; ComponentLink11Description: https://datasheet.ciiva.com/8896/pyu-rc0603-51-rohs-l-4-8896106.pdf?src-supplier=Avnet; ComponentLink12URL: https://datasheet.ciiva.com/15189/getdatasheetpartid-404327-15189644.pdf?src-supplier=Verical; ComponentLink12Description: https://datasheet.ciiva.com/15189/getdatasheetpartid-404327-15189644.pdf?src-supplier=Verical; ComponentLink13URL: https://datasheet.ciiva.com/7983/443971-7983613.pdf?src-supplier=Element14; ComponentLink13Description: https://datasheet.ciiva.com/7983/443971-7983613.pdf?src-supplier=Element14
  R12: NC: NC
R2 = Resistor_Chip: Ceramic, SMT Capacitor; Manufacturer: Yageo; Manufacturer Part Number: RC0603JR-0713KL; Description: Thick Film Resistors 13K OHM 5%; Tolerance: 5%; Power Rating: 100mW; Voltage Rating: 75V; Voltage Rating (DC): 50V; Temperature Coefficient: 100ppm/°C; Supplier 1: Digi-Key; Supplier Part Number 1: 311-13KGRCT-ND; Stock 1: 338462; Pricing 1: 1 = 0,10000, 10 = 0,01900, 100 = 0,00770, 1000 = 0,00347, 2500 = 0,00301 (USD); RoHS: Yes; Case/Package: 0603; Weight: 7.1E-05oz; Case Code (Metric): 1608; Case Code (Imperial): 0603; Contact Plating: Tin,Matte; Min Operating Temperature: -55°C; Max Operating Temperature: 155°C; Termination: SMD/SMT; Composition: Thick Film; Military Standard: Not; Resistance: 13kR; Packaging: Tape and Reel; Length: 1.6mm; Height: 0.45mm; Width: 0.8mm; Depth: 0.8mm; Radiation Hardening: No; Lead Free: Lead Free; ComponentLink1URL: https://datasheet.ciiva.com/8890/pyu-rc0603-51-rohs-l-4-8890984.pdf?src-supplier=Avnet; ComponentLink1Description: https://datasheet.ciiva.com/8890/pyu-rc0603-51-rohs-l-4-8890984.pdf?src-supplier=Avnet; ComponentLink2URL: https://datasheet.ciiva.com/12577/rc0603-272842-12577401.pdf?src-supplier=Mouser; ComponentLink2Description: https://datasheet.ciiva.com/12577/rc0603-272842-12577401.pdf?src-supplier=Mouser
R3 = Resistor_Chip: Ceramic, SMT Capacitor; Manufacturer: Yageo; Manufacturer Part Number: RC0603FR-076K98L; Description: RES SMD 6.98K OHM 1% 1/10W 0603; Tolerance: 1%; Power Rating: 100mW; Voltage Rating (DC): 50V; Temperature Coefficient: 100ppm/°C; Working Voltage: 75V; ComponentLink1URL: https://datasheet.ciiva.com/11808/0900766b80f96399-11808081.pdf?src-supplier=RSComponents; ComponentLink1Description: https://datasheet.ciiva.com/11808/0900766b80f96399-11808081.pdf?src-supplier=RSComponents; ComponentLink2URL: https://datasheet.ciiva.com/25906/pyu-rc0603-51-rohs-l-4-25906933.pdf?src-supplier=Avnet+Europe; ComponentLink2Description: https://datasheet.ciiva.com/25906/pyu-rc0603-51-rohs-l-4-25906933.pdf?src-supplier=Avnet+Europe; ComponentLink3URL: https://datasheet.ciiva.com/7660/1868787-7660790.pdf?src-supplier=Element14; ComponentLink3Description: https://datasheet.ciiva.com/7660/1868787-7660790.pdf?src-supplier=Element14; ComponentLink4URL: https://datasheet.ciiva.com/7746/1738695-7746279.pdf?src-supplier=Element14; ComponentLink4Description: https://datasheet.ciiva.com/7746/1738695-7746279.pdf?src-supplier=Element14; ComponentLink5URL: https://datasheet.ciiva.com/7746/1686128-7746280.pdf?src-supplier=Element14; ComponentLink5Description: https://datasheet.ciiva.com/7746/1686128-7746280.pdf?src-supplier=Element14; ComponentLink6URL: https://datasheet.ciiva.com/28386/pyu-rc0603-51-rohs-l-4-28386648.pdf?src-supplier=Avnet+Europe; ComponentLink6Description: https://datasheet.ciiva.com/28386/pyu-rc0603-51-rohs-l-4-28386648.pdf?src-supplier=Avnet+Europe; ComponentLink7URL: https://datasheet.ciiva.com/7746/1738695-7746281.pdf?src-supplier=Element14; ComponentLink7Description: https://datasheet.ciiva.com/7746/1738695-7746281.pdf?src-supplier=Element14; ComponentLink8URL: https://datasheet.ciiva.com/8896/pyu-rc0603-51-rohs-l-4-8896106.pdf?src-supplier=Avnet; ComponentLink8Description: https://datasheet.ciiva.com/8896/pyu-rc0603-51-rohs-l-4-8896106.pdf?src-supplier=Avnet; ComponentLink9URL: https://datasheet.ciiva.com/15189/getdatasheetpartid-404327-15189644.pdf?src-supplier=Verical; ComponentLink9Description: https://datasheet.ciiva.com/15189/getdatasheetpartid-404327-15189644.pdf?src-supplier=Verical; ComponentLink10URL: https://datasheet.ciiva.com/7983/443971-7983613.pdf?src-supplier=Element14; ComponentLink10Description: https://datasheet.ciiva.com/7983/443971-7983613.pdf?src-supplier=Element14; Supplier 1: Digi-Key; Supplier Part Number 1: 311-6.98KHRCT-ND; Stock 1: 185868; Pricing 1: 1 = 0,10000, 10 = 0,02300, 100 = 0,00940, 1000 = 0,00421, 2500 = 0,00366 (USD); RoHS: Yes; Case/Package: 0603; Case Code (Imperial): 0603; Case Code (Metric): 1608; Min Operating Temperature: -55°C; Max Operating Temperature: 155°C; Resistance: 6.98kR; Packaging: Tape and Reel; Military Standard: Not; Composition: Thick Film; Features: Moisture Resistant; Package Quantity: 1; Number of Terminations: 2; Max Power Dissipation: 100mW; Length: 0.063inch; Height: 0.022inch; Width: 0.031inch; Depth: 0.8mm; Lead Free: Lead Free; ComponentLink11URL: https://datasheet.ciiva.com/2553/pyu-r-int-thick-7-2553542.pdf?src-supplier=Digi-Key; ComponentLink11Description: https://datasheet.ciiva.com/2553/pyu-r-int-thick-7-2553542.pdf?src-supplier=Digi-Key; ComponentLink12URL: https://datasheet.ciiva.com/2553/pyu-r-int-thick-7-2553543.pdf?src-supplier=Digi-Key; ComponentLink12Description: https://datasheet.ciiva.com/2553/pyu-r-int-thick-7-2553543.pdf?src-supplier=Digi-Key; ComponentLink13URL: https://datasheet.ciiva.com/2553/pyu-r-int-thick-7-2553544.pdf?src-supplier=Digi-Key; ComponentLink13Description: https://datasheet.ciiva.com/2553/pyu-r-int-thick-7-2553544.pdf?src-supplier=Digi-Key
R4 = Resistor_Chip: Ceramic, SMT Capacitor; Manufacturer: Yageo; Manufacturer Part Number: RC0603FR-071K24L; Description: RES SMD 1.24K OHM 1% 1/10W 0603; Tolerance: 1%; Voltage Rating (DC): 50V; Temperature Coefficient: 100ppm/°C; Power Rating: 100mW; ComponentLink1URL: http://www.mouser.com/ds/2/447/RC0603-272842.pdf?src-supplier=Mouser; ComponentLink1Description: http://www.mouser.com/ds/2/447/RC0603-272842.pdf?src-supplier=Mouser; ComponentLink2URL: http://components.arrow.com/part/dataview/0323_03541353?src-supplier=Arrow+Europe; ComponentLink2Description: http://components.arrow.com/part/dataview/0323_03541353?src-supplier=Arrow+Europe; ComponentLink3URL: http://www.yageo.com/documents/recent/PYu-RC_Group_51_RoHS_L_9.pdf?src-supplier=Digi-Key; ComponentLink3Description: http://www.yageo.com/documents/recent/PYu-RC_Group_51_RoHS_L_9.pdf?src-supplier=Digi-Key; ComponentLink4URL: http://www.yageo.com/documents/recent/PYu-RC0603_51_RoHS_L_4.pdf?src-supplier=Avnet+Europe; ComponentLink4Description: http://www.yageo.com/documents/recent/PYu-RC0603_51_RoHS_L_4.pdf?src-supplier=Avnet+Europe; ComponentLink5URL: http://www.yageo.com/documents/recent/PYu-RC_Group_51_RoHS_L_10.pdf?src-supplier=Digi-Key; ComponentLink5Description: http://www.yageo.com/documents/recent/PYu-RC_Group_51_RoHS_L_10.pdf?src-supplier=Digi-Key; ComponentLink6URL: http://www.yageo.com/documents/recent/PYu-RC0603_51_RoHS_L_4.pdf?src-supplier=Avnet; ComponentLink6Description: http://www.yageo.com/documents/recent/PYu-RC0603_51_RoHS_L_4.pdf?src-supplier=Avnet; ComponentLink7URL: http://www.yageo.com/documents/recent/PYu-RC0603_51_RoHS_L_7.pdf?src-supplier=Future+Electronics; ComponentLink7Description: http://www.yageo.com/documents/recent/PYu-RC0603_51_RoHS_L_7.pdf?src-supplier=Future+Electronics; Supplier 1: Digi-Key; Supplier Part Number 1: 311-1.24KHRCT-ND; Stock 1: 189612; Pricing 1: 1 = 0,10000, 10 = 0,02300, 100 = 0,00940, 1000 = 0,00421, 2500 = 0,00366 (USD); RoHS: Yes; Mount: Surface Mount; Case/Package: 0603; Case Code (Metric): 1608; Case Code (Imperial): 0603; Min Operating Temperature: -55°C; Max Operating Temperature: 155°C; Packaging: Tape and Reel; Resistance: 1.24kR; Composition: Thick Film; Package Quantity: 1; Voltage Rating: 50V; Max Power Dissipation: 100mW; Number of Terminations: 2; Termination: SMD/SMT; Military Standard: Not; Features: Moisture Resistant; Length: 1.6mm; Height: 0.45mm; Width: 0.031inch; Depth: 0.8mm; Lead Free: Lead Free; ComponentLink8URL: https://datasheet.ciiva.com/11809/0900766b80f96399-11809244.pdf?src-supplier=RSComponents; ComponentLink8Description: https://datasheet.ciiva.com/11809/0900766b80f96399-11809244.pdf?src-supplier=RSComponents; ComponentLink9URL: https://datasheet.ciiva.com/2454/pyu-r-int-thick-7-2454258.pdf?src-supplier=Digi-Key; ComponentLink9Description: https://datasheet.ciiva.com/2454/pyu-r-int-thick-7-2454258.pdf?src-supplier=Digi-Key; ComponentLink10URL: https://datasheet.ciiva.com/2454/pyu-r-int-thick-7-2454259.pdf?src-supplier=Digi-Key; ComponentLink10Description: https://datasheet.ciiva.com/2454/pyu-r-int-thick-7-2454259.pdf?src-supplier=Digi-Key; ComponentLink11URL: https://datasheet.ciiva.com/2454/pyu-r-int-thick-7-2454260.pdf?src-supplier=Digi-Key; ComponentLink11Description: https://datasheet.ciiva.com/2454/pyu-r-int-thick-7-2454260.pdf?src-supplier=Digi-Key
R5 = Resistor_Chip: Ceramic, SMT Capacitor; Manufacturer: Yageo Phycomp; Manufacturer Part Number: RC0603FR-074K99L; Description: YAGEO - RC0603FR-074K99L - RES, THICK FILM, 4K99, 1%, 0.1W, 0603, REEL; Voltage Rating (DC): 50V; Tolerance: 1%; Power Rating: 100mW; Temperature Coefficient: 100ppm/°C; ComponentLink1URL: https://datasheet.ciiva.com/11808/0900766b80f96399-11808081.pdf?src-supplier=RSComponents; ComponentLink1Description: https://datasheet.ciiva.com/11808/0900766b80f96399-11808081.pdf?src-supplier=RSComponents; ComponentLink2URL: https://datasheet.ciiva.com/25906/pyu-rc0603-51-rohs-l-4-25906933.pdf?src-supplier=Avnet+Europe; ComponentLink2Description: https://datasheet.ciiva.com/25906/pyu-rc0603-51-rohs-l-4-25906933.pdf?src-supplier=Avnet+Europe; ComponentLink3URL: https://datasheet.ciiva.com/7660/1868787-7660790.pdf?src-supplier=Element14; ComponentLink3Description: https://datasheet.ciiva.com/7660/1868787-7660790.pdf?src-supplier=Element14; ComponentLink4URL: https://datasheet.ciiva.com/7746/1738695-7746279.pdf?src-supplier=Element14; ComponentLink4Description: https://datasheet.ciiva.com/7746/1738695-7746279.pdf?src-supplier=Element14; ComponentLink5URL: https://datasheet.ciiva.com/7746/1686128-7746280.pdf?src-supplier=Element14; ComponentLink5Description: https://datasheet.ciiva.com/7746/1686128-7746280.pdf?src-supplier=Element14; ComponentLink6URL: https://datasheet.ciiva.com/28386/pyu-rc0603-51-rohs-l-4-28386648.pdf?src-supplier=Avnet+Europe; ComponentLink6Description: https://datasheet.ciiva.com/28386/pyu-rc0603-51-rohs-l-4-28386648.pdf?src-supplier=Avnet+Europe; ComponentLink7URL: https://datasheet.ciiva.com/7746/1738695-7746281.pdf?src-supplier=Element14; ComponentLink7Description: https://datasheet.ciiva.com/7746/1738695-7746281.pdf?src-supplier=Element14; ComponentLink8URL: https://datasheet.ciiva.com/8896/pyu-rc0603-51-rohs-l-4-8896106.pdf?src-supplier=Avnet; ComponentLink8Description: https://datasheet.ciiva.com/8896/pyu-rc0603-51-rohs-l-4-8896106.pdf?src-supplier=Avnet; ComponentLink9URL: https://datasheet.ciiva.com/15189/getdatasheetpartid-404327-15189644.pdf?src-supplier=Verical; ComponentLink9Description: https://datasheet.ciiva.com/15189/getdatasheetpartid-404327-15189644.pdf?src-supplier=Verical; ComponentLink10URL: https://datasheet.ciiva.com/7983/443971-7983613.pdf?src-supplier=Element14; ComponentLink10Description: https://datasheet.ciiva.com/7983/443971-7983613.pdf?src-supplier=Element14; Supplier 1: Digi-Key; Supplier Part Number 1: 311-4.99KHRCT-ND; Stock 1: 2436445; Pricing 1: 1 = 0,10000, 10 = 0,02300, 100 = 0,00940, 1000 = 0,00421, 2500 = 0,00366 (USD); RoHS: Yes; Mount: Surface Mount; Case/Package: 0603; Number of Pins: 2; Min Operating Temperature: -55°C; Max Operating Temperature: 155°C; Packaging: Cut Tape; Resistance: 4.99kR; Length: 1.6mm; Height: 0.45mm; Width: 800um; Depth: 0.8mm; Lead Free: Lead Free; ComponentLink11URL: http://www.farnell.com/datasheets/2167052.pdf?src-supplier=Farnell; ComponentLink11Description: http://www.farnell.com/datasheets/2167052.pdf?src-supplier=Farnell; ComponentLink12URL: http://www.yageo.com/documents/recent/PYu-RC_Group_51_RoHS_L_9.pdf?src-supplier=Digi-Key; ComponentLink12Description: http://www.yageo.com/documents/recent/PYu-RC_Group_51_RoHS_L_9.pdf?src-supplier=Digi-Key; ComponentLink13URL: http://www.yageo.com/documents/recent/PYu-RC_Group_51_RoHS_L_10.pdf?src-supplier=Digi-Key; ComponentLink13Description: http://www.yageo.com/documents/recent/PYu-RC_Group_51_RoHS_L_10.pdf?src-supplier=Digi-Key; ComponentLink14URL: http://www.farnell.com/datasheets/2167052.pdf?src-supplier=Newark; ComponentLink14Description: http://www.farnell.com/datasheets/2167052.pdf?src-supplier=Newark